# EAGLE schematic Proiect (EAGLE 9.7.0)
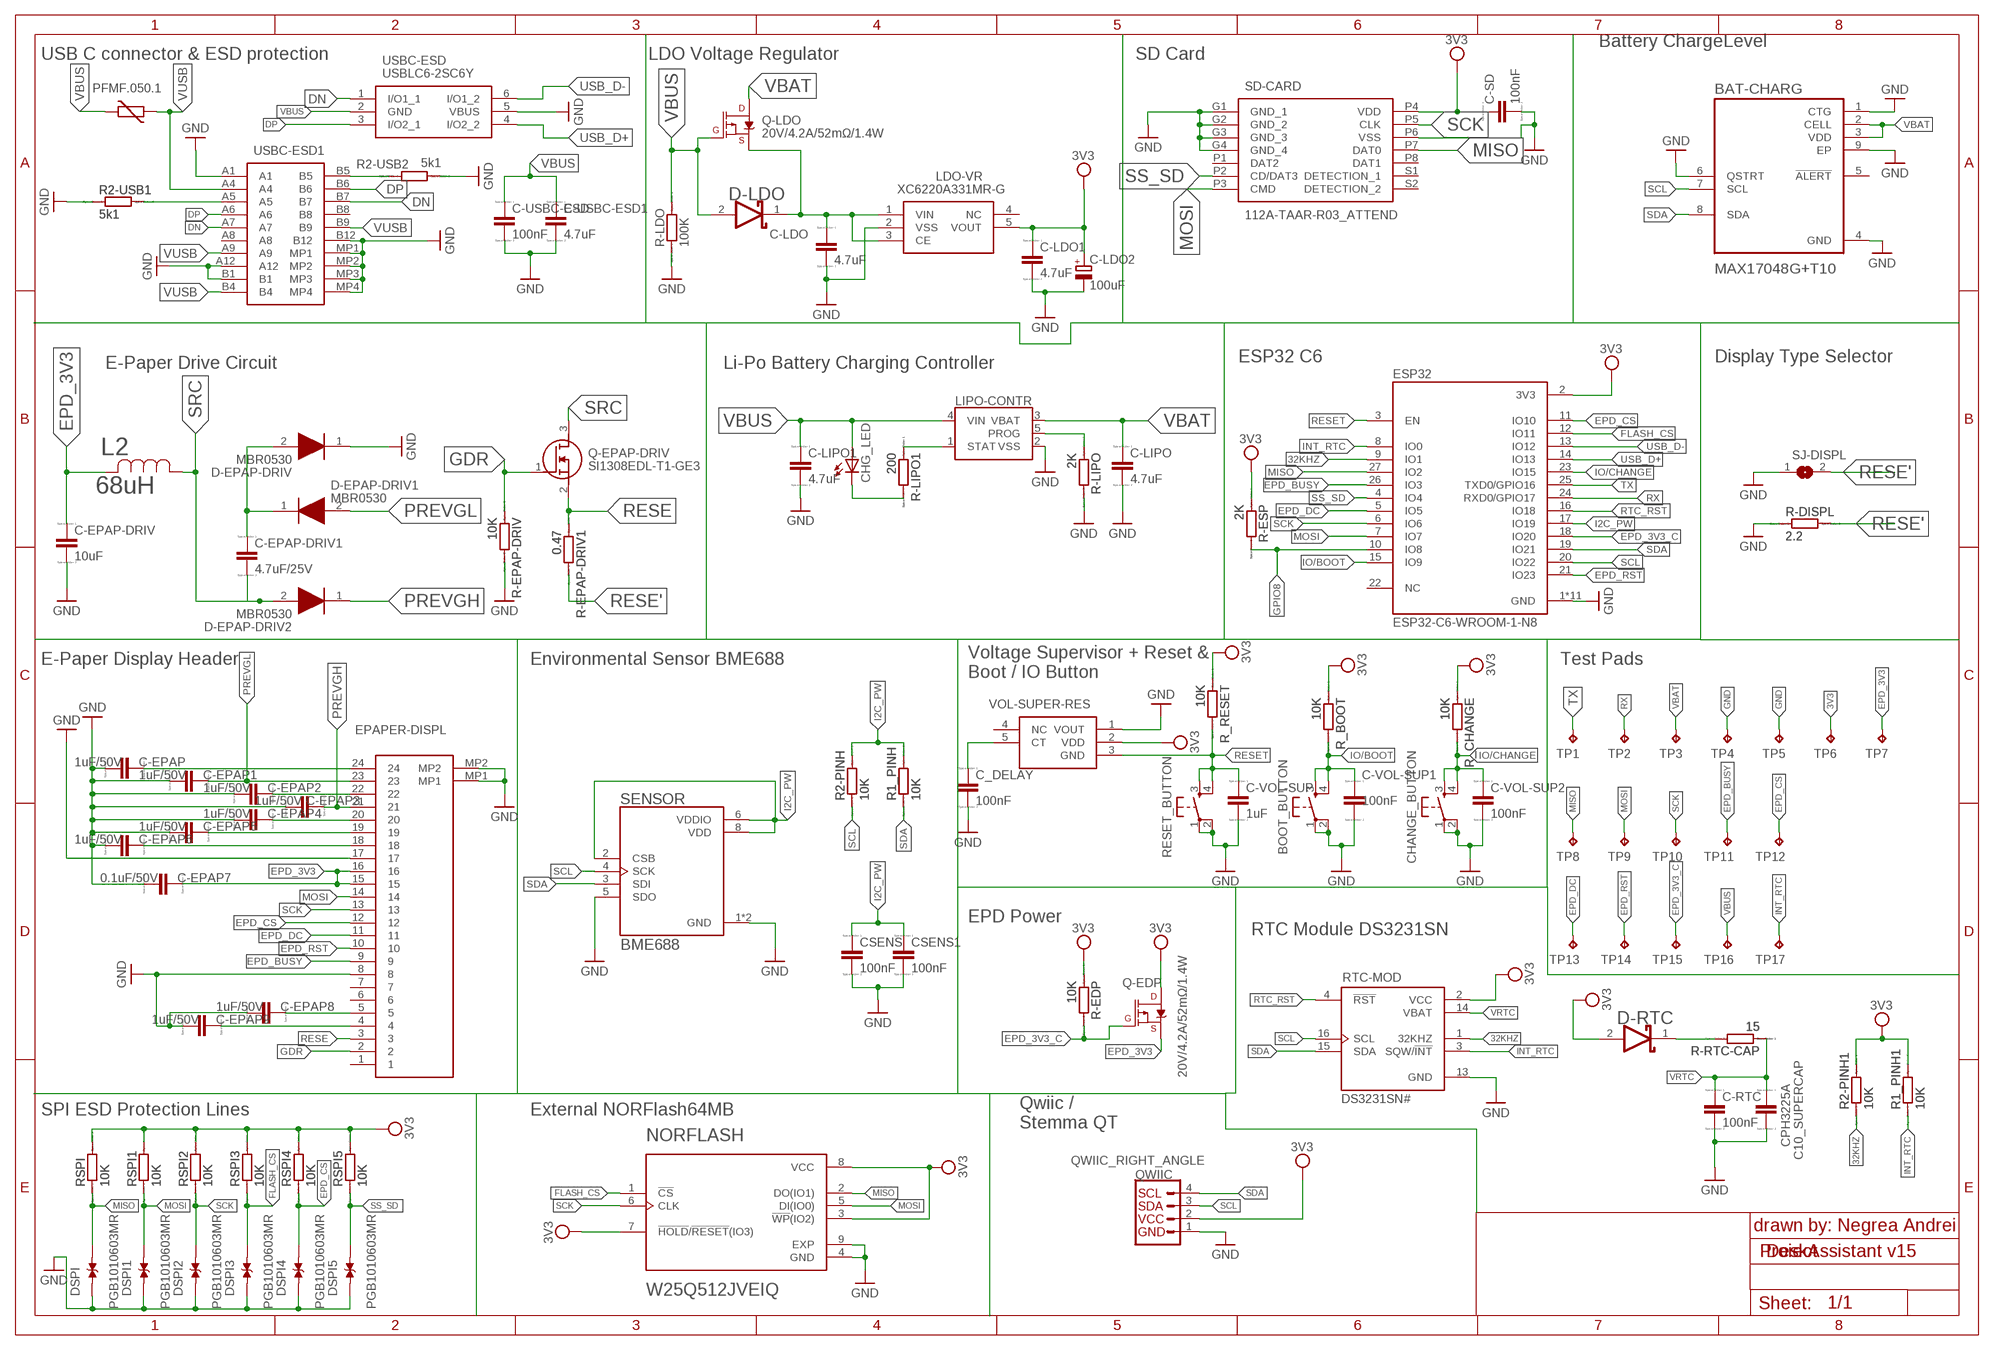
[diagram p0: schematic, sheet 1]

## Parts
BAT-CHARG  MAX17048G+T10  [SON50P200X200X80-9N]
BOOT_BUTTON  BOOT_BUTTON  BUTTON_CUSYOMV1  [MYBUTTON]
C-EPAP  1uF/50V  ESP32_WROVER_EAGLE-LTSPICE_CC0402  [ESP32_WROVER_EAGLE-LTSPICE_C0402]
C-EPAP1  1uF/50V  ESP32_WROVER_EAGLE-LTSPICE_CC0402  [ESP32_WROVER_EAGLE-LTSPICE_C0402]
C-EPAP2  1uF/50V  ESP32_WROVER_EAGLE-LTSPICE_CC0402  [ESP32_WROVER_EAGLE-LTSPICE_C0402]
C-EPAP3  1uF/50V  ESP32_WROVER_EAGLE-LTSPICE_CC0402  [ESP32_WROVER_EAGLE-LTSPICE_C0402]
C-EPAP4  1uF/50V  ESP32_WROVER_EAGLE-LTSPICE_CC0402  [ESP32_WROVER_EAGLE-LTSPICE_C0402]
C-EPAP5  1uF/50V  ESP32_WROVER_EAGLE-LTSPICE_CC0402  [ESP32_WROVER_EAGLE-LTSPICE_C0402]
C-EPAP6  1uF/50V  ESP32_WROVER_EAGLE-LTSPICE_CC0402  [ESP32_WROVER_EAGLE-LTSPICE_C0402]
C-EPAP7  0.1uF/50V  ESP32_WROVER_EAGLE-LTSPICE_CC0402  [ESP32_WROVER_EAGLE-LTSPICE_C0402]
C-EPAP8  1uF/50V  ESP32_WROVER_EAGLE-LTSPICE_CC0402  [ESP32_WROVER_EAGLE-LTSPICE_C0402]
C-EPAP9  1uF/50V  ESP32_WROVER_EAGLE-LTSPICE_CC0402  [ESP32_WROVER_EAGLE-LTSPICE_C0402]
C-EPAP-DRIV  10uF  ESP32_WROVER_EAGLE-LTSPICE_CC0402  [ESP32_WROVER_EAGLE-LTSPICE_C0402]
C-EPAP-DRIV1  4.7uF/25V  ESP32_WROVER_EAGLE-LTSPICE_CC0402  [ESP32_WROVER_EAGLE-LTSPICE_C0402]
C-LDO  4.7uF  ESP32_WROVER_EAGLE-LTSPICE_CC0402  [ESP32_WROVER_EAGLE-LTSPICE_C0402]
C-LDO1  4.7uF  ESP32_WROVER_EAGLE-LTSPICE_CC0402  [ESP32_WROVER_EAGLE-LTSPICE_C0402]
C-LDO2  100uF  RCL_CPOL-EUCT3528  [RCL_CT3528]
C-LIPO  4.7uF  ESP32_WROVER_EAGLE-LTSPICE_CC0402  [ESP32_WROVER_EAGLE-LTSPICE_C0402]
C-LIPO1  4.7uF  ESP32_WROVER_EAGLE-LTSPICE_CC0402  [ESP32_WROVER_EAGLE-LTSPICE_C0402]
C-RTC  100nF  ESP32_WROVER_EAGLE-LTSPICE_CC0402  [ESP32_WROVER_EAGLE-LTSPICE_C0402]
C-SD  100nF  ESP32_WROVER_EAGLE-LTSPICE_CC0402  [ESP32_WROVER_EAGLE-LTSPICE_C0402]
C-USBC-ESD  100nF  ESP32_WROVER_EAGLE-LTSPICE_CC0402  [ESP32_WROVER_EAGLE-LTSPICE_C0402]
C-USBC-ESD1  4.7uF  ESP32_WROVER_EAGLE-LTSPICE_CC0402  [ESP32_WROVER_EAGLE-LTSPICE_C0402]
C-VOL-SUP  1uF  ESP32_WROVER_EAGLE-LTSPICE_CC0402  [ESP32_WROVER_EAGLE-LTSPICE_C0402]
C-VOL-SUP1  100nF  ESP32_WROVER_EAGLE-LTSPICE_CC0402  [ESP32_WROVER_EAGLE-LTSPICE_C0402]
C-VOL-SUP2  100nF  ESP32_WROVER_EAGLE-LTSPICE_CC0402  [ESP32_WROVER_EAGLE-LTSPICE_C0402]
C_DELAY  100nF  ESP32_WROVER_EAGLE-LTSPICE_CC0402  [ESP32_WROVER_EAGLE-LTSPICE_C0402]
CHANGE_BUTTON  CHANGE_BUTTON  BUTTON_CUSYOMV1  [MYBUTTON]
CHG_LED  ADAFRUIT_LEDCHIP-LED0603  [ADAFRUIT_CHIP-LED0603]
CPH3225A  C10_SUPERCAP  ESP32_WROVER_EAGLE-LTSPICE_CC0402  [ESP32_WROVER_EAGLE-LTSPICE_C0402]
CSENS  100nF  ESP32_WROVER_EAGLE-LTSPICE_CC0402  [ESP32_WROVER_EAGLE-LTSPICE_C0402]
CSENS1  100nF  ESP32_WROVER_EAGLE-LTSPICE_CC0402  [ESP32_WROVER_EAGLE-LTSPICE_C0402]
D-EPAP-DRIV  MBR0530  [SOD3716X135N]
D-EPAP-DRIV1  MBR0530  [SOD3716X135N]
D-EPAP-DRIV2  MBR0530  [SOD3716X135N]
D-LDO  ESP32_WROVER_AVX---SD0805S020S1R0_AVX_SD0805S020S1R0_0_0AVX_SD0805S020S1R0_0_0  [ESP32_WROVER_AVX---SD0805S020S1R0_AVX_SD0805S020S1R0_0]
D-RTC  ESP32_WROVER_AVX---SD0805S020S1R0_AVX_SD0805S020S1R0_0_0AVX_SD0805S020S1R0_0_0  [ESP32_WROVER_AVX---SD0805S020S1R0_AVX_SD0805S020S1R0_0]
DSPI  PGB1010603MR  [DIOC1608X36N]
DSPI1  PGB1010603MR  [DIOC1608X36N]
DSPI2  PGB1010603MR  [DIOC1608X36N]
DSPI3  PGB1010603MR  [DIOC1608X36N]
DSPI4  PGB1010603MR  [DIOC1608X36N]
DSPI5  PGB1010603MR  [DIOC1608X36N]
EPAPER-DISPL  FH34SRJ-24S-0.5SH_99_  [FH34SRJ24S05SH99]
ESP32  ESP32-C6-WROOM-1-N8  [XCVR_ESP32-C6-WROOM-1-N8]
L2  68uH  744043680IND_4828-WE-TPC_WRE  [IND_4828-WE-TPC_WRE]
LDO-VR  XC6220A331MR-G  [SOT95P280X120-5N]
LIPO-CONTR  ESP32_WROVER_SPARKFUN-IC-POWER_MCP73831  [ESP32_WROVER_SPARKFUN-IC-POWER_SOT23-5]
NORFLASH  W25Q512JVEIQ  [SON127P600X800X80-9N]
PFMF.050.1  ESP32C6_VARISTORCN1812  [ESP32C6_VARISTOR_CT/CN1812]
Q-EDP  20V/4.2A/52mΩ/1.4W  ESP32_WROVER_SPARKFUN-DISCRETESEMI_MOSFET_PCH-DMG2305UX-7  [ESP32_WROVER_SPARKFUN-DISCRETESEMI_SOT23-3]
Q-EPAP-DRIV  SI1308EDL-T1-GE3  [SOT65P210X110-3N]
Q-LDO  20V/4.2A/52mΩ/1.4W  ESP32_WROVER_SPARKFUN-DISCRETESEMI_MOSFET_PCH-DMG2305UX-7  [ESP32_WROVER_SPARKFUN-DISCRETESEMI_SOT23-3]
QWIIC  QWIIC_RIGHT_ANGLE  QWIIC_CONNECTORJS-1MM  [JST04_1MM_RA]
R1_PINH  10K  ESP32_WROVER_EAGLE-LTSPICE_RR0402  [ESP32_WROVER_EAGLE-LTSPICE_R0402]
R1_PINH1  10K  ESP32_WROVER_EAGLE-LTSPICE_RR0402  [ESP32_WROVER_EAGLE-LTSPICE_R0402]
R2-PINH  10K  ESP32_WROVER_EAGLE-LTSPICE_RR0402  [ESP32_WROVER_EAGLE-LTSPICE_R0402]
R2-PINH1  10K  ESP32_WROVER_EAGLE-LTSPICE_RR0402  [ESP32_WROVER_EAGLE-LTSPICE_R0402]
R2-USB1  5k1  ESP32_WROVER_EAGLE-LTSPICE_RR0402  [ESP32_WROVER_EAGLE-LTSPICE_R0402]
R2-USB2  5k1  ESP32_WROVER_EAGLE-LTSPICE_RR0402  [ESP32_WROVER_EAGLE-LTSPICE_R0402]
R-DISPL  2.2  ESP32_WROVER_EAGLE-LTSPICE_RR0402  [ESP32_WROVER_EAGLE-LTSPICE_R0402]
R-EDP  10K  ESP32_WROVER_EAGLE-LTSPICE_RR0402  [ESP32_WROVER_EAGLE-LTSPICE_R0402]
R-EPAP-DRIV  10K  ESP32_WROVER_EAGLE-LTSPICE_RR0402  [ESP32_WROVER_EAGLE-LTSPICE_R0402]
R-EPAP-DRIV1  0.47  ESP32_WROVER_EAGLE-LTSPICE_RR0402  [ESP32_WROVER_EAGLE-LTSPICE_R0402]
R-ESP  2K  ESP32_WROVER_EAGLE-LTSPICE_RR0402  [ESP32_WROVER_EAGLE-LTSPICE_R0402]
R-LDO  100K  ESP32_WROVER_EAGLE-LTSPICE_RR0402  [ESP32_WROVER_EAGLE-LTSPICE_R0402]
R-LIPO  2K  ESP32_WROVER_EAGLE-LTSPICE_RR0402  [ESP32_WROVER_EAGLE-LTSPICE_R0402]
R-LIPO1  200  ESP32_WROVER_EAGLE-LTSPICE_RR0402  [ESP32_WROVER_EAGLE-LTSPICE_R0402]
R-RTC-CAP  15  ESP32_WROVER_EAGLE-LTSPICE_RR0402  [ESP32_WROVER_EAGLE-LTSPICE_R0402]
R_BOOT  10K  ESP32_WROVER_EAGLE-LTSPICE_RR0402  [ESP32_WROVER_EAGLE-LTSPICE_R0402]
R_CHANGE  10K  ESP32_WROVER_EAGLE-LTSPICE_RR0402  [ESP32_WROVER_EAGLE-LTSPICE_R0402]
R_RESET  10K  ESP32_WROVER_EAGLE-LTSPICE_RR0402  [ESP32_WROVER_EAGLE-LTSPICE_R0402]
RESET_BUTTON  RESET_BUTTON  BUTTON_CUSYOMV1  [MYBUTTON]
RSPI  10K  ESP32_WROVER_EAGLE-LTSPICE_RR0402  [ESP32_WROVER_EAGLE-LTSPICE_R0402]
RSPI1  10K  ESP32_WROVER_EAGLE-LTSPICE_RR0402  [ESP32_WROVER_EAGLE-LTSPICE_R0402]
RSPI2  10K  ESP32_WROVER_EAGLE-LTSPICE_RR0402  [ESP32_WROVER_EAGLE-LTSPICE_R0402]
RSPI3  10K  ESP32_WROVER_EAGLE-LTSPICE_RR0402  [ESP32_WROVER_EAGLE-LTSPICE_R0402]
RSPI4  10K  ESP32_WROVER_EAGLE-LTSPICE_RR0402  [ESP32_WROVER_EAGLE-LTSPICE_R0402]
RSPI5  10K  ESP32_WROVER_EAGLE-LTSPICE_RR0402  [ESP32_WROVER_EAGLE-LTSPICE_R0402]
RTC-MOD  DS3231SN#  [SOIC127P1032X265-16N]
SD-CARD  112A-TAAR-R03_ATTEND  [112ATAARR03ATTEND]
SENSOR  BME688  ESP32_WROVER_BME680_BME680  [ESP32_WROVER_BME680_PSON80P300X300X100-8N]
SJ-DISPL  SJ  [SJ]
TP1  TPTP20R  [TP20R]
TP2  TPTP20R  [TP20R]
TP3  TPTP20R  [TP20R]
TP4  TPTP20R  [TP20R]
TP5  TPTP20R  [TP20R]
TP6  TPTP20R  [TP20R]
TP7  TPTP20R  [TP20R]
TP8  TPTP20R  [TP20R]
TP9  TPTP20R  [TP20R]
TP10  TPTP20R  [TP20R]
TP11  TPTP20R  [TP20R]
TP12  TPTP20R  [TP20R]
TP13  TPTP20R  [TP20R]
TP14  TPTP20R  [TP20R]
TP15  TPTP20R  [TP20R]
TP16  TPTP20R  [TP20R]
TP17  TPTP20R  [TP20R]
USBC-ESD  USBLC6-2SC6Y  [SOT95P280X145-6N]
USBC-ESD1  SAMACSYS_PARTS_USB4110-GF-A  [SAMACSYS_PARTS_USB4110GFA]
VOL-SUPER  VOL-SUPER-RES  BD5229G-TR  [SOT95P280X125-5N]

## Nets
3V3 [POWER]: C-LDO1.1 C-LDO2.+ C-SD.1 D-RTC.2(ANODE) ESP32.2(3V3) LDO-VR.5(VOUT) NORFLASH.3(!WP!(IO2)) NORFLASH.7(!HOLD!/!RESET!(IO3)) NORFLASH.8(VCC) Q-EDP.3(D) QWIIC.2 R1_PINH1.2 R2-PINH1.2 R-EDP.1 R-ESP.1 R_BOOT.1 R_CHANGE.1 R_RESET.1 RSPI1.2 RSPI2.2 RSPI3.2 RSPI4.2 RSPI5.2 RSPI.2 RTC-MOD.2(VCC) SD-CARD.P4(VDD) TP6.TP VOL-SUPER.2(VDD)
32KHZ: ESP32.9(IO1) R2-PINH1.1 RTC-MOD.1(32KHZ)
DN: USBC-ESD1.A7 USBC-ESD1.B7 USBC-ESD.1(I/O1_1)
DP: USBC-ESD1.A6 USBC-ESD1.B6 USBC-ESD.3(I/O2_1)
EPD_3V3 [POWER]: C-EPAP7.1 C-EPAP-DRIV.1 EPAPER-DISPL.15 EPAPER-DISPL.16 L2.2 Q-EDP.2(S) TP7.TP
EPD_3V3_C [POWER]: ESP32.18(IO20) Q-EDP.1(G) R-EDP.2 TP15.TP
EPD_BUSY: EPAPER-DISPL.9 ESP32.26(IO3) TP11.TP
EPD_CS: DSPI4.2 EPAPER-DISPL.12 ESP32.11(IO10) RSPI4.1 TP12.TP
EPD_DC: EPAPER-DISPL.11 ESP32.5(IO5) TP13.TP
EPD_RST: EPAPER-DISPL.10 ESP32.21(IO23) TP14.TP
FLASH_CS: DSPI3.2 ESP32.12(IO11) NORFLASH.1(!CS) RSPI3.1
GDR: EPAPER-DISPL.2 Q-EPAP-DRIV.1(G) R-EPAP-DRIV.1
GND: BAT-CHARG.1(CTG) BAT-CHARG.4(GND) BAT-CHARG.6(QSTRT) BAT-CHARG.9(EP) BOOT_BUTTON.1 BOOT_BUTTON.2 C-EPAP1.2 C-EPAP2.2 C-EPAP3.2 C-EPAP4.2 C-EPAP5.2 C-EPAP6.2 C-EPAP7.2 C-EPAP8.2 C-EPAP9.2 C-EPAP-DRIV.2 C-EPAP.2 C-LDO1.2 C-LDO2.- C-LDO.2 C-LIPO1.2 C-LIPO.2 C-RTC.2 C-SD.2 C-USBC-ESD1.2 C-USBC-ESD.2 C-VOL-SUP1.2 C-VOL-SUP2.2 C-VOL-SUP.2 C_DELAY.2 CHANGE_BUTTON.1 CHANGE_BUTTON.2 CPH3225A.2 CSENS1.2 CSENS.2 D-EPAP-DRIV.1(K) DSPI1.1 DSPI2.1 DSPI3.1 DSPI4.1 DSPI5.1 DSPI.1 EPAPER-DISPL.8 EPAPER-DISPL.17 EPAPER-DISPL.MP1 EPAPER-DISPL.MP2 ESP32.1(GND) ESP32.28(GND) ESP32.29_1(GND) ESP32.29_2(GND) ESP32.29_3(GND) ESP32.29_4(GND) ESP32.29_5(GND) ESP32.29_6(GND) ESP32.29_7(GND) ESP32.29_8(GND) ESP32.29_9(GND) LDO-VR.2(VSS) LIPO-CONTR.2(VSS) NORFLASH.4(GND) NORFLASH.9(EXP) QWIIC.1 R2-USB1.1 R2-USB2.2 R-DISPL.1 R-EPAP-DRIV.2 R-LDO.1 R-LIPO.2 RESET_BUTTON.1 RESET_BUTTON.2 RTC-MOD.13(GND) SD-CARD.G1(GND_1) SD-CARD.G2(GND_2) SD-CARD.G3(GND_3) SD-CARD.G4(GND_4) SD-CARD.P6(VSS) SENSOR.1(GND) SENSOR.5(SDO) SENSOR.7(GND) SJ-DISPL.1 TP4.TP TP5.TP USBC-ESD1.A1 USBC-ESD1.A12 USBC-ESD1.B1 USBC-ESD1.B12 USBC-ESD1.MP1 USBC-ESD1.MP2 USBC-ESD1.MP3 USBC-ESD1.MP4 USBC-ESD.5(VBUS) VOL-SUPER.1(VOUT)
GPIO8: ESP32.10(IO8) R-ESP.2
I2C_PW: CSENS1.1 CSENS.1 ESP32.17(IO19) R1_PINH.2 R2-PINH.2 SENSOR.2(CSB) SENSOR.6(VDDIO) SENSOR.8(VDD)
INT_RTC: ESP32.8(IO0) R1_PINH1.1 RTC-MOD.3(SQW/!INT) TP17.TP
IO/BOOT: BOOT_BUTTON.3 BOOT_BUTTON.4 C-VOL-SUP1.1 ESP32.15(IO9) R_BOOT.2
IO/CHANGE: C-VOL-SUP2.1 CHANGE_BUTTON.3 CHANGE_BUTTON.4 ESP32.23(IO15) R_CHANGE.2
MISO: DSPI.2 ESP32.27(IO2) NORFLASH.2(DO(IO1)) RSPI.1 SD-CARD.P7(DAT0) TP8.TP
MOSI: DSPI1.2 EPAPER-DISPL.14 ESP32.7(IO7) NORFLASH.5(DI(IO0)) RSPI1.1 SD-CARD.P3(CMD) TP9.TP
N$1: R2-USB1.2 USBC-ESD1.A5
N$2: R2-USB2.1 USBC-ESD1.B5
N$3: C-EPAP.1 EPAPER-DISPL.24
N$4: CHG_LED.C R-LIPO1.2
N$6: LIPO-CONTR.1(STAT) R-LIPO1.1
N$7: LIPO-CONTR.5(PROG) R-LIPO.1
N$9: C-EPAP2.1 EPAPER-DISPL.22
N$10: C-EPAP-DRIV1.1 D-EPAP-DRIV1.1(K) D-EPAP-DRIV.2(A)
N$12: C-EPAP4.1 EPAPER-DISPL.20
N$13: C-EPAP5.1 EPAPER-DISPL.19
N$14: C-EPAP6.1 EPAPER-DISPL.18
N$15: C_DELAY.1 VOL-SUPER.5(CT)
N$16: C-EPAP8.1 EPAPER-DISPL.5
N$17: C-EPAP9.1 EPAPER-DISPL.4
N$18: C-LDO.1 D-LDO.1(CATHODE) LDO-VR.1(VIN) LDO-VR.3(CE) Q-LDO.2(S)
N$24: D-RTC.1(CATHODE) R-RTC-CAP.2
PREVGH: C-EPAP3.1 D-EPAP-DRIV2.1(K) EPAPER-DISPL.21
PREVGL: C-EPAP1.1 D-EPAP-DRIV1.2(A) EPAPER-DISPL.23
RESE: EPAPER-DISPL.3 Q-EPAP-DRIV.2(S) R-EPAP-DRIV1.1
RESE': R-DISPL.2 R-EPAP-DRIV1.2 SJ-DISPL.2
RESET: C-VOL-SUP.1 ESP32.3(EN) R_RESET.2 RESET_BUTTON.3 RESET_BUTTON.4 VOL-SUPER.3(GND)
RTC_RST: ESP32.16(IO18) RTC-MOD.4(!RST)
RX: ESP32.24(RXD0/GPIO17) TP2.TP
SCK: DSPI2.2 EPAPER-DISPL.13 ESP32.6(IO6) NORFLASH.6(CLK) RSPI2.1 SD-CARD.P5(CLK) TP10.TP
SCL: BAT-CHARG.7(SCL) ESP32.20(IO22) QWIIC.3 R2-PINH.1 RTC-MOD.16(SCL) SENSOR.4(SCK)
SDA: BAT-CHARG.8(SDA) ESP32.19(IO21) QWIIC.4 R1_PINH.1 RTC-MOD.15(SDA) SENSOR.3(SDI)
SRC: C-EPAP-DRIV1.2 D-EPAP-DRIV2.2(A) L2.1 Q-EPAP-DRIV.3(D)
SS_SD: DSPI5.2 ESP32.4(IO4) RSPI5.1 SD-CARD.P2(CD/DAT3)
TX: ESP32.25(TXD0/GPIO16) TP1.TP
USB_D+: ESP32.14(IO13) USBC-ESD.4(I/O2_2)
USB_D-: ESP32.13(IO12) USBC-ESD.6(I/O1_2)
VBAT [POWER]: BAT-CHARG.2(CELL) BAT-CHARG.3(VDD) C-LIPO.1 LIPO-CONTR.3(VBAT) Q-LDO.3(D) TP3.TP
VBUS [POWER]: C-LIPO1.1 C-USBC-ESD1.1 C-USBC-ESD.1 CHG_LED.A D-LDO.2(ANODE) LIPO-CONTR.4(VIN) PFMF.050.1.2 Q-LDO.1(G) R-LDO.2 TP16.TP USBC-ESD.2(GND)
VRTC: C-RTC.1 CPH3225A.1 R-RTC-CAP.1 RTC-MOD.14(VBAT)
VUSB [POWER]: PFMF.050.1.1 USBC-ESD1.A4 USBC-ESD1.A9 USBC-ESD1.B4 USBC-ESD1.B9
Unconnected: BAT-CHARG.5(!ALERT) EPAPER-DISPL.1 EPAPER-DISPL.6 EPAPER-DISPL.7 ESP32.22(NC) LDO-VR.4(NC) SD-CARD.P1(DAT2) SD-CARD.P8(DAT1) SD-CARD.S1(DETECTION_1) SD-CARD.S2(DETECTION_2) USBC-ESD1.A8 USBC-ESD1.B8 VOL-SUPER.4(NC)

## Buses
B$1

## Notes on the sheet
- LDO Voltage Regulator | Battery ChargeLevel
- USB C connector & ESD protection | SD Card
- E-Paper Drive Circuit | Li-Po Battery Charging Controller
- ESP32 C6 | Display Type Selector
- E-Paper Display Header | Environmental Sensor BME688 | Test Pads
- Voltage Supervisor + Reset &
  Boot / IO Button
- EPD Power
- RTC Module DS3231SN
- SPI ESD Protection Lines | External NORFlash64MB
- Qwiic /
  Stemma QT
- drawn by: Negrea Andrei
- DeskAssistant v15

## Library data of the parts
BAT-CHARG = DeskAssistant v19 v1dsa:MAX17048G+T10: Check availability <https://pricing.snapeda.com/parts/MAX17048G%2BT10/Analog%20Devices/view-part?ref=eda>; AVAILABILITY: In Stock; CHECK_PRICES: https://www.snapeda.com/parts/MAX17048G+T10/Analog+Devices/view-part/?ref=eda; DESCRIPTION: 3µA 1-Cell/2-Cell Fuel Gauge with ModelGauge; MF: Analog Devices; MP: MAX17048G+T10; PACKAGE: TDFN-8 Maxim; PRICE: None; PURCHASE-URL: https://www.snapeda.com/api/url_track_click_mouser/?unipart_id=329239&manufacturer=Analog Devices&part_name=MAX17048G+T10&search_term=None; SNAPEDA_LINK: https://www.snapeda.com/parts/MAX17048G+T10/Analog+Devices/view-part/?ref=snap
BOOT_BUTTON CHANGE_BUTTON RESET_BUTTON = DeskAssistant v19 v1dsa:BUTTON_CUSYOMV1
C-EPAP C-EPAP1-C-EPAP9 C-EPAP-DRIV C-EPAP-DRIV1 C-LDO C-LDO1 C-LIPO C-LIPO1 C-RTC C-SD C-USBC-ESD C-USBC-ESD1 C-VOL-SUP C-VOL-SUP1 C-VOL-SUP2 C_DELAY CPH3225A CSENS CSENS1 = DeskAssistant v19 v1dsa:ESP32_WROVER_EAGLE-LTSPICE_C: CAPACITOR, European symbol; SPICEMODEL: NONE; SPICEPREFIX: C
C-LDO2 = DeskAssistant v19 v1dsa:RCL_CPOL-EU: POLARIZED CAPACITOR, European symbol; SPICEPREFIX: C
CHG_LED = DeskAssistant v19 v1dsa:ADAFRUIT_LED: LED OSRAM: - CHIPLED LG R971, LG N971, LY N971, LG Q971, LY Q971, LO R971, LY R971 LH N974, LH R974 LS Q976, LO Q976, LY Q976 LO Q996 - Hyper CHIPLED LW Q18S LB Q993, LB Q99A, LB R99A - SideLED LS A670, LO A670, LY A670, LG A670, LP A670 LB A673, LV A673, LT A673, LW A673 LH A674 LY A675 LS A676, LA A676, LO A676, LY A676, LW A676 LS A679, LY A679, LG A679 - Hyper Micro SIDELED® LS Y876, LA Y876, LO Y876, LY Y876 LT Y87S - SmartLED LW L88C, LW L88S LB L89C, LB L89S, LG L890 LS L89K, LO L89K, LY L89K LS L896, LA L896, LO L896, LY L896 - TOPLED LS T670, LO T670, LY T670, LG T670, LP T670 LSG T670, LSP T670, LSY T670, LOP T670, LYG T670 LG T671, LOG T671, LSG T671 LB T673, LV T673, LT T673, LW T673 LH T674 LS T676, LA T676, LO T676, LY T676, LB T676, LH T676, LSB T676, LW T676 LB T67C, LV T67C, LT T67C, LS T67K, LO T67K, LY T67K, LW E67C LS E67B, LA E67B, LO E67B, LY E67B, LB E67C, LV E67C, LT E67C LW T67C LS T679, LY T679, LG T679 LS T770, LO T770, LY T770, LG T770, LP T770 LB T773, LV T773, LT T773, LW T773 LH T774 LS E675, LA E675, LY E675, LS T675 LS T776, LA T776, LO T776, LY T776, LB T776 LHGB T686 LT T68C, LB T68C - Hyper Mini TOPLED® LB M676 - Mini TOPLED Santana® LG M470 LS M47K, LO M47K, LY M47K Source: http://www.osram.convergy.de/
D-EPAP-DRIV D-EPAP-DRIV1 D-EPAP-DRIV2 = DeskAssistant v19 v1dsa:MBR0530: ON SEMICONDUCTOR - MBR0530 - DIODE, SCHOTTKY, 0.5A, 30V, SOD-123 Source: Datasheet <http://www.onsemi.com/pub/Collateral/MBR0530T1-D.PDF> Check availability <https://pricing.snapeda.com/parts/MBR0530/ON%20Semiconductor/view-part?ref=eda>; AVAILABILITY: In Stock; CHECK_PRICES: https://www.snapeda.com/parts/MBR0530/Onsemi/view-part/?ref=eda; DESCRIPTION: Diode Schottky 30 V 500mA Surface Mount SOD-123; MF: ON Semiconductor; MP: MBR0530; PACKAGE: SOD-123-2 ON Semiconductor; PRICE: None; PURCHASE-URL: https://www.snapeda.com/api/url_track_click_mouser/?unipart_id=179458&manufacturer=ON Semiconductor&part_name=MBR0530&search_term=None; SNAPEDA_LINK: https://www.snapeda.com/parts/MBR0530/Onsemi/view-part/?ref=snap
D-LDO D-RTC = DeskAssistant v19 v1dsa:ESP32_WROVER_AVX---SD0805S020S1R0_AVX_SD0805S020S1R0_0_0: Schottky Barrier Rectifier Diode; CENTROID_NOT_SPECIFIED: No; DATASHEET: http://datasheets.avx.com/schottky.pdf; DIGIKEY_DESCRIPTION: DIODE SCHOTTKY 20V 1A 0805; DIGIKEY_PART_NUMBER: 478-7800-1-ND; LEAD_FREE: yes; MF: AVX; MOUSER_PART_NUMBER: 581-SD0805S020S1R0; PACKAGE: 0805 (2012 metric); PREFIX: D; ROHS: yes; TEMPERATURE_RANGE_HIGH: +125°C; TEMPERATURE_RANGE_LOW: -55°C
DSPI DSPI1-DSPI5 = DeskAssistant v19 v1dsa:PGB1010603MR: Check availability <https://pricing.snapeda.com/parts/PGB1010603MR/Littelfuse%20Inc./view-part?ref=eda>; AVAILABILITY: In Stock; CHECK_PRICES: https://www.snapeda.com/parts/PGB1010603MR/Littelfuse/view-part/?ref=eda; DESCRIPTION: 150V (Typ) Clamp - Ipp Tvs Diode Surface Mount 0603 (1608 Metric); MF: Littelfuse Inc.; MP: PGB1010603MR; PACKAGE: 0603 Littelfuse Inc.; PRICE: None; PURCHASE-URL: https://www.snapeda.com/api/url_track_click_mouser/?unipart_id=5659453&manufacturer=Littelfuse Inc.&part_name=PGB1010603MR&search_term=None; SNAPEDA_LINK: https://www.snapeda.com/parts/PGB1010603MR/Littelfuse/view-part/?ref=snap
EPAPER-DISPL = DeskAssistant v19 v1dsa:FH34SRJ-24S-0.5SH_99_: 24 Position FFC, FPC Connector Contacts, Top and Bottom 0.020" (0.50mm) Surface Mount, Right Angle Source: Datasheet <https://www.hirose.com/en/product/document?clcode=CL0580-1255-6-99&productname=FH34SRJ-24S-0.5SH(99)&series=FH34SRJ&documenttype=2DDrawing&lang=en&documentid=0000990903>; DESCRIPTION: 24 Position FFC, FPC Connector Contacts, Top and Bottom 0.020" (0.50mm) Surface Mount, Right Angle; HEIGHT: 1.1mm; MANUFACTURER_NAME: Hirose; MANUFACTURER_PART_NUMBER: FH34SRJ-24S-0.5SH(99); MOUSER_PART_NUMBER: 798-FH34SRJ24S05SH99; MOUSER_PRICE-STOCK: https://www.mouser.co.uk/ProductDetail/Hirose-Connector/FH34SRJ-24S-0.5SH99?qs=vcbW%252B4%252BSTIpKBl5ap9J8Fw%3D%3D
ESP32 = DeskAssistant v19 v1dsa:ESP32-C6-WROOM-1-N8: Check availability <https://pricing.snapeda.com/parts/ESP32-C6-WROOM-1-N8/Espressif%20Systems/view-part?ref=eda>; AVAILABILITY: In Stock; CHECK_PRICES: https://www.snapeda.com/parts/ESP32-C6-WROOM-1-N8/Espressif+Systems/view-part/?ref=eda; DESCRIPTION: Multiprotocol Modules ESP32-C6 module, Wi-Fi 6 in 2.4 GHz band, Bluetooth 5, Zigbee 3.0 and Thread. ESP34-WROOM Compatible - ENGINEERING SAMPLE; MF: Espressif Systems; MP: ESP32-C6-WROOM-1-N8; PACKAGE: None; PRICE: None; SNAPEDA_LINK: https://www.snapeda.com/parts/ESP32-C6-WROOM-1-N8/Espressif+Systems/view-part/?ref=snap
L2 = DeskAssistant v19 v1dsa:744043680; COPYRIGHT: Copyright (C) 2024 Ultra Librarian. All rights reserved.; MANUFACTURER_PART_NUMBER: 744043680; MFR_NAME: Wurth Electronics
LDO-VR = DeskAssistant v19 v1dsa:XC6220A331MR-G: LDO Voltage Regulators Source: Datasheet <https://www.torexsemi.com/file/xc6220/XC6220.pdf>; DESCRIPTION: LDO Voltage Regulators; HEIGHT: 1.2mm; MANUFACTURER_NAME: Torex; MANUFACTURER_PART_NUMBER: XC6220A331MR-G; MOUSER_PART_NUMBER: 865-XC6220A331MR-G; MOUSER_PRICE-STOCK: https://www.mouser.co.uk/ProductDetail/Torex-Semiconductor/XC6220A331MR-G?qs=AsjdqWjXhJ8ZSWznL1J0gg%3D%3D
LIPO-CONTR = DeskAssistant v19 v1dsa:ESP32_WROVER_SPARKFUN-IC-POWER_MCP73831: MCP73831T Li-Ion, Li-Pol Controller Miniature single cell, fully integrated Li-Ion, Li-polymer charge management controller Datasheet <http://ww1.microchip.com/downloads/en/DeviceDoc/20001984g.pdf> SparkFun Products: SparkFun ESP32 Thing <https://www.sparkfun.com/products/13907> SparkFun 9DoF Razor IMU M0 <https://www.sparkfun.com/products/14001>; PROD_ID: IC-09995
NORFLASH = DeskAssistant v19 v1dsa:W25Q512JVEIQ: Check availability <https://pricing.snapeda.com/parts/W25Q512JVEIQ/Winbond%20Electronics/view-part?ref=eda>; AVAILABILITY: In Stock; CHECK_PRICES: https://www.snapeda.com/parts/W25Q512JVEIQ/Winbond+Electronics/view-part/?ref=eda; DESCRIPTION: FLASH - NOR Memory IC 512Mb (64M x 8) SPI - Quad I/O 133 MHz 8-WSON (8x6); MF: Winbond Electronics; MP: W25Q512JVEIQ; PACKAGE: Package; PRICE: None; SNAPEDA_LINK: https://www.snapeda.com/parts/W25Q512JVEIQ/Winbond+Electronics/view-part/?ref=snap
PFMF.050.1 = DeskAssistant v19 v1dsa:ESP32C6_VARISTOR: VARISTOR
Q-EDP Q-LDO = DeskAssistant v19 v1dsa:ESP32_WROVER_SPARKFUN-DISCRETESEMI_MOSFET_PCH: P-channel MOSFETs Voltage controlled devices that allow control of high current outputs. SparkFun Products: SparkFun ESP32 Thing <https://www.sparkfun.com/products/13907> SparkFun ESP8266 Thing <https://www.sparkfun.com/products/13231> SparkFun Pi Servo HAT V2 <https://www.sparkfun.com/products/15316> DMG2305UX-7 (20V/4.2A/SOT23-3); PROD_ID: TRAN-14388
Q-EPAP-DRIV = DeskAssistant v19 v1dsa:SI1308EDL-T1-GE3: MOSFET N-Ch 30V 1.5A TrenchFET SC70 Vishay Si1308EDL-T1-GE3 N-channel MOSFET Transistor, 1.5 A, 30 V, 3-Pin SC-70 Source: Datasheet <https://componentsearchengine.com/Datasheets/1/SI1308EDL-T1-GE3.pdf> Check availability <https://pricing.snapeda.com/parts/SI1308EDL-T1-GE3/Vishay%20Siliconix/view-part?ref=eda>; AVAILABILITY: In Stock; CHECK_PRICES: https://www.snapeda.com/parts/SI1308EDL-T1-GE3/Vishay+Siliconix/view-part/?ref=eda; DESCRIPTION: Si1308EDL-T1-GE3 N-channel MOSFET Transistor, 1.5 A, 30 V, 3-Pin SC-70 | Siliconix / Vishay SI1308EDL-T1-GE3; MF: Vishay Siliconix; MP: SI1308EDL-T1-GE3; PACKAGE: SOT-323 Vishay Semiconductor; PRICE: None; PURCHASE-URL: https://www.snapeda.com/api/url_track_click_mouser/?unipart_id=274603&manufacturer=Vishay Siliconix&part_name=SI1308EDL-T1-GE3&search_term=None; SNAPEDA_LINK: https://www.snapeda.com/parts/SI1308EDL-T1-GE3/Vishay+Siliconix/view-part/?ref=snap
QWIIC = DeskAssistant v19 v1dsa:QWIIC_CONNECTOR: SparkFun I2C Standard Qwiic Connector An SMD 1mm pitch JST connector makes it easy and quick (get it? Qwiic?) to connect I2C devices to each other. The Qwiic system <http://www.sparkfun.com/qwiic> enables fast and solderless connection between popular platforms and various sensors and actuators. We carry 200mm <https://www.sparkfun.com/products/14204>, 100mm <https://www.sparkfun.com/products/14205>, 50mm <https://www.sparkfun.com/products/14206>, and breadboard friendly <https://www.sparkfun.com/products/14207> Qwiic cables. We also offer 10 pcs strips <https://www.sparkfun.com/products/14323> the SMD connectors.; PROD_ID: CONN-13694
R1_PINH R1_PINH1 R2-PINH R2-PINH1 R2-USB1 R2-USB2 R-DISPL R-EDP R-EPAP-DRIV R-EPAP-DRIV1 R-ESP R-LDO R-LIPO R-LIPO1 R-RTC-CAP R_BOOT R_CHANGE R_RESET RSPI RSPI1-RSPI5 = DeskAssistant v19 v1dsa:ESP32_WROVER_EAGLE-LTSPICE_R: RESISTOR, European symbol; SPICEMODEL: NONE; SPICEPREFIX: R
RTC-MOD = DeskAssistant v19 v1dsa:DS3231SN#: Real Time Clock Serial 16-Pin SOIC W T/R Check availability <https://pricing.snapeda.com/parts/DS3231SN%23/Analog%20Devices/view-part?ref=eda>; AVAILABILITY: In Stock; CHECK_PRICES: https://www.snapeda.com/parts/DS3231SN%23/Analog+Devices/view-part/?ref=eda; DESCRIPTION: Extremely Accurate I²C-Integrated RTC/TCXO/Crystal; MF: Analog Devices; MP: DS3231SN#; PACKAGE: SOIC-16 Maxim; PRICE: None; PURCHASE-URL: https://www.snapeda.com/api/url_track_click_mouser/?unipart_id=99048&manufacturer=Analog Devices&part_name=DS3231SN#&search_term=None; SNAPEDA_LINK: https://www.snapeda.com/parts/DS3231SN%23/Analog+Devices/view-part/?ref=snap
SD-CARD = DeskAssistant v19 v1dsa:112A-TAAR-R03_ATTEND: Micro SD Card Socket, Push-Push Type, Top Mount, SMT, H=1.83mm, 10u Source: Datasheet <https://www.attend.com.tw/data/download/file/112A-TAAR-R03.pdf>; DESCRIPTION: Micro SD Card Socket, Push-Push Type, Top Mount, SMT, H=1.83mm, 10u; HEIGHT: 1.9mm; MANUFACTURER_NAME: ATTEND; MANUFACTURER_PART_NUMBER: 112A-TAAR-R03 ATTEND
SENSOR = DeskAssistant v19 v1dsa:ESP32_WROVER_BME680_BME680: Integrated Environmental Unit; AVAILABILITY: Unavailable; DESCRIPTION: Integrated Environmental Unit; MF: Bosch Sensortec; MP: BME680; PACKAGE: LGA-8 Bosch Tools; PRICE: None
SJ-DISPL = DeskAssistant v19 v1dsa:SJ: SMD solder JUMPER
TP1-TP17 = DeskAssistant v19 v1dsa:TP: Test pad
USBC-ESD = DeskAssistant v19 v1dsa:USBLC6-2SC6Y: Low Cap. ESD Protection Auto SOT-23-6 STMicroelectronics USBLC6-2SC6Y, Dual Uni-Directional TVS Diode Array, 6-Pin SOT-23 Source: Datasheet <https://componentsearchengine.com/Datasheets/1/USBLC6-2SC6Y.pdf> Check availability <https://pricing.snapeda.com/parts/USBLC6-2SC6Y/STMicroelectronics/view-part?ref=eda>; AVAILABILITY: In Stock; CHECK_PRICES: https://www.snapeda.com/parts/USBLC6-2SC6Y/STMicroelectronics/view-part/?ref=eda; DESCRIPTION: 17V Clamp 5A (8/20µs) Ipp Tvs Diode Surface Mount SOT-23-6; MF: STMicroelectronics; MP: USBLC6-2SC6Y; PACKAGE: SOT-23-6 STMicroelectronics; PRICE: None; SNAPEDA_LINK: https://www.snapeda.com/parts/USBLC6-2SC6Y/STMicroelectronics/view-part/?ref=snap
USBC-ESD1 = DeskAssistant v19 v1dsa:SAMACSYS_PARTS_USB4110-GF-A: CONN USB 2.0 TYPE-C R/A SMT Source: Datasheet <https://gct.co/files/drawings/usb4110.pdf>; DESCRIPTION: CONN USB 2.0 TYPE-C R/A SMT; HEIGHT: 3.26mm; MANUFACTURER_NAME: GCT (GLOBAL CONNECTOR TECHNOLOGY); MANUFACTURER_PART_NUMBER: USB4110-GF-A; MOUSER_PART_NUMBER: 640-USB4110-GF-A; MOUSER_PRICE-STOCK: https://www.mouser.co.uk/ProductDetail/GCT/USB4110-GF-A?qs=KUoIvG%2F9IlYiZvIXQjyJeA%3D%3D
VOL-SUPER = DeskAssistant v19 v1dsa:BD5229G-TR: Voltage Detector with Adjustable Delay Time: CMOS processes are utilized to develop high precision, low current consumption CMOS reset ICs that allow arbitrary setting of the delay time. The extensive lineup includes both Nch Open Drain and CMOS output types in a wide range of detection voltages (from 2.3V to 6.0V, in 0.1V steps), enabling selection of the ideal solution based on customer requirements. In addition, the entire series is of course both lead-free and RoHS-compliant. Source: Datasheet <https://datasheet.datasheetarchive.com/originals/distributors/Datasheets_SAMA/f2b9741ef86007909f138d561a359946.pdf>; DESCRIPTION: Voltage Detector with Adjustable Delay Time: CMOS processes are utilized to develop high precision, low current consumption CMOS reset ICs that allow arbitrary setting of the delay time. The extensive lineup includes both Nch Open Drain and CMOS output types in a wide range of detection voltages (from 2.3V to 6.0V, in 0.1V steps), enabling selection of the ideal solution based on customer requirements. In addition, the entire series is of course both lead-free and RoHS-compliant.; HEIGHT: 1.25mm; MANUFACTURER_NAME: ROHM Semiconductor; MANUFACTURER_PART_NUMBER: BD5229G-TR; MOUSER_PART_NUMBER: 755-BD5229G-TR; MOUSER_PRICE-STOCK: https://www.mouser.co.uk/ProductDetail/ROHM-Semiconductor/BD5229G-TR?qs=4kLU8WoGk0vvnhrrYwdszw%3D%3D

## Net classes
2 POWER: width 0.3 mm